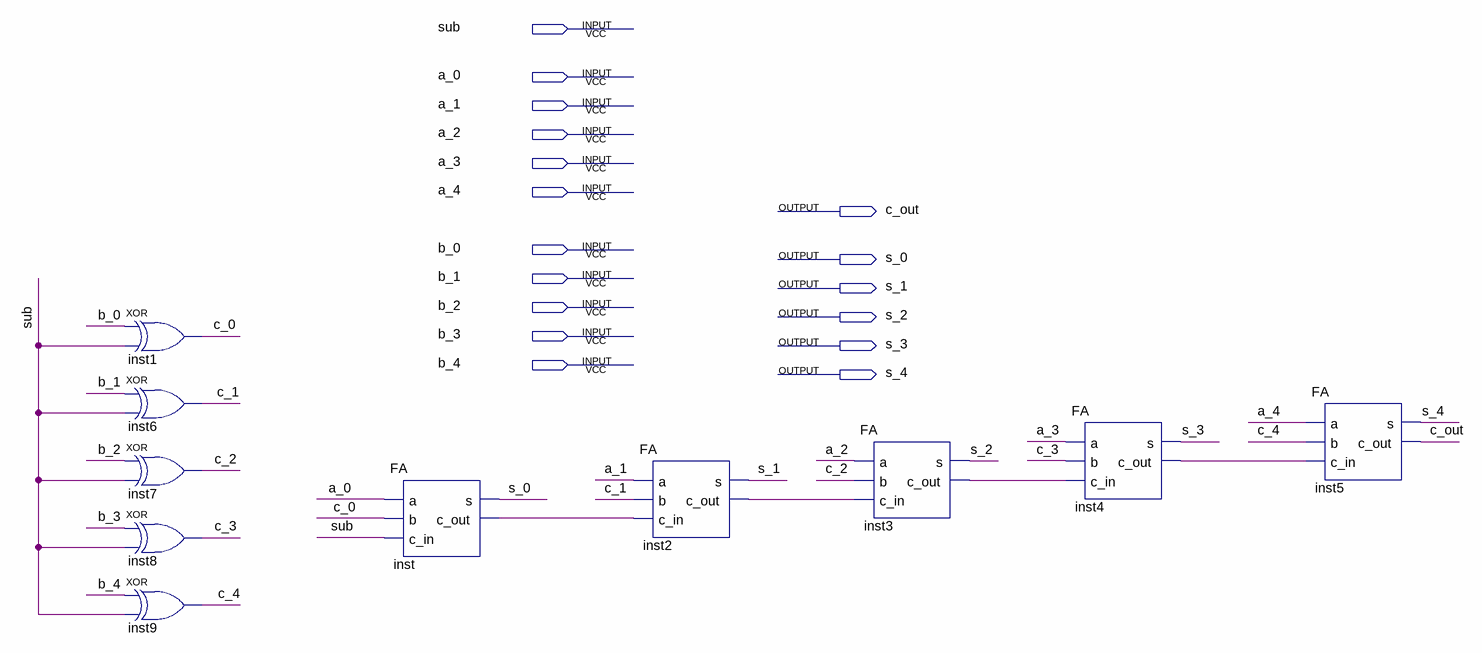
[diagram p0: schematic sheet]
// Quartus schematic Adder_Subtractor_5bit.bdf as structural Verilog: 10 symbols, 17 pins
module Adder_Subtractor_5bit (
  input  sub,
  input  a_0,
  input  a_1,
  input  a_2,
  input  a_3,
  input  a_4,
  input  b_0,
  input  b_1,
  input  b_2,
  input  b_3,
  input  b_4,
  output c_out,
  output s_0,
  output s_1,
  output s_2,
  output s_3,
  output s_4
);

  wire c_0, c_1, c_2, c_3, c_4, inst2_c_out, inst3_c_out, inst4_c_out, inst_c_out;

  xor inst1 (c_0, b_0, sub);
  xor inst6 (c_1, b_1, sub);
  xor inst7 (c_2, b_2, sub);
  xor inst8 (c_3, b_3, sub);
  xor inst9 (c_4, b_4, sub);
  FA inst (.a(a_0), .b(c_0), .c_in(sub), .s(s_0), .c_out(inst_c_out));
  FA inst2 (.a(a_1), .b(c_1), .c_in(inst_c_out), .s(s_1), .c_out(inst2_c_out));
  FA inst3 (.a(a_2), .b(c_2), .c_in(inst2_c_out), .s(s_2), .c_out(inst3_c_out));
  FA inst4 (.a(a_3), .b(c_3), .c_in(inst3_c_out), .s(s_3), .c_out(inst4_c_out));
  FA inst5 (.a(a_4), .b(c_4), .c_in(inst4_c_out), .s(s_4), .c_out(c_out));
endmodule
